# EAGLE design TicTacToe (EAGLE 7.2.0)
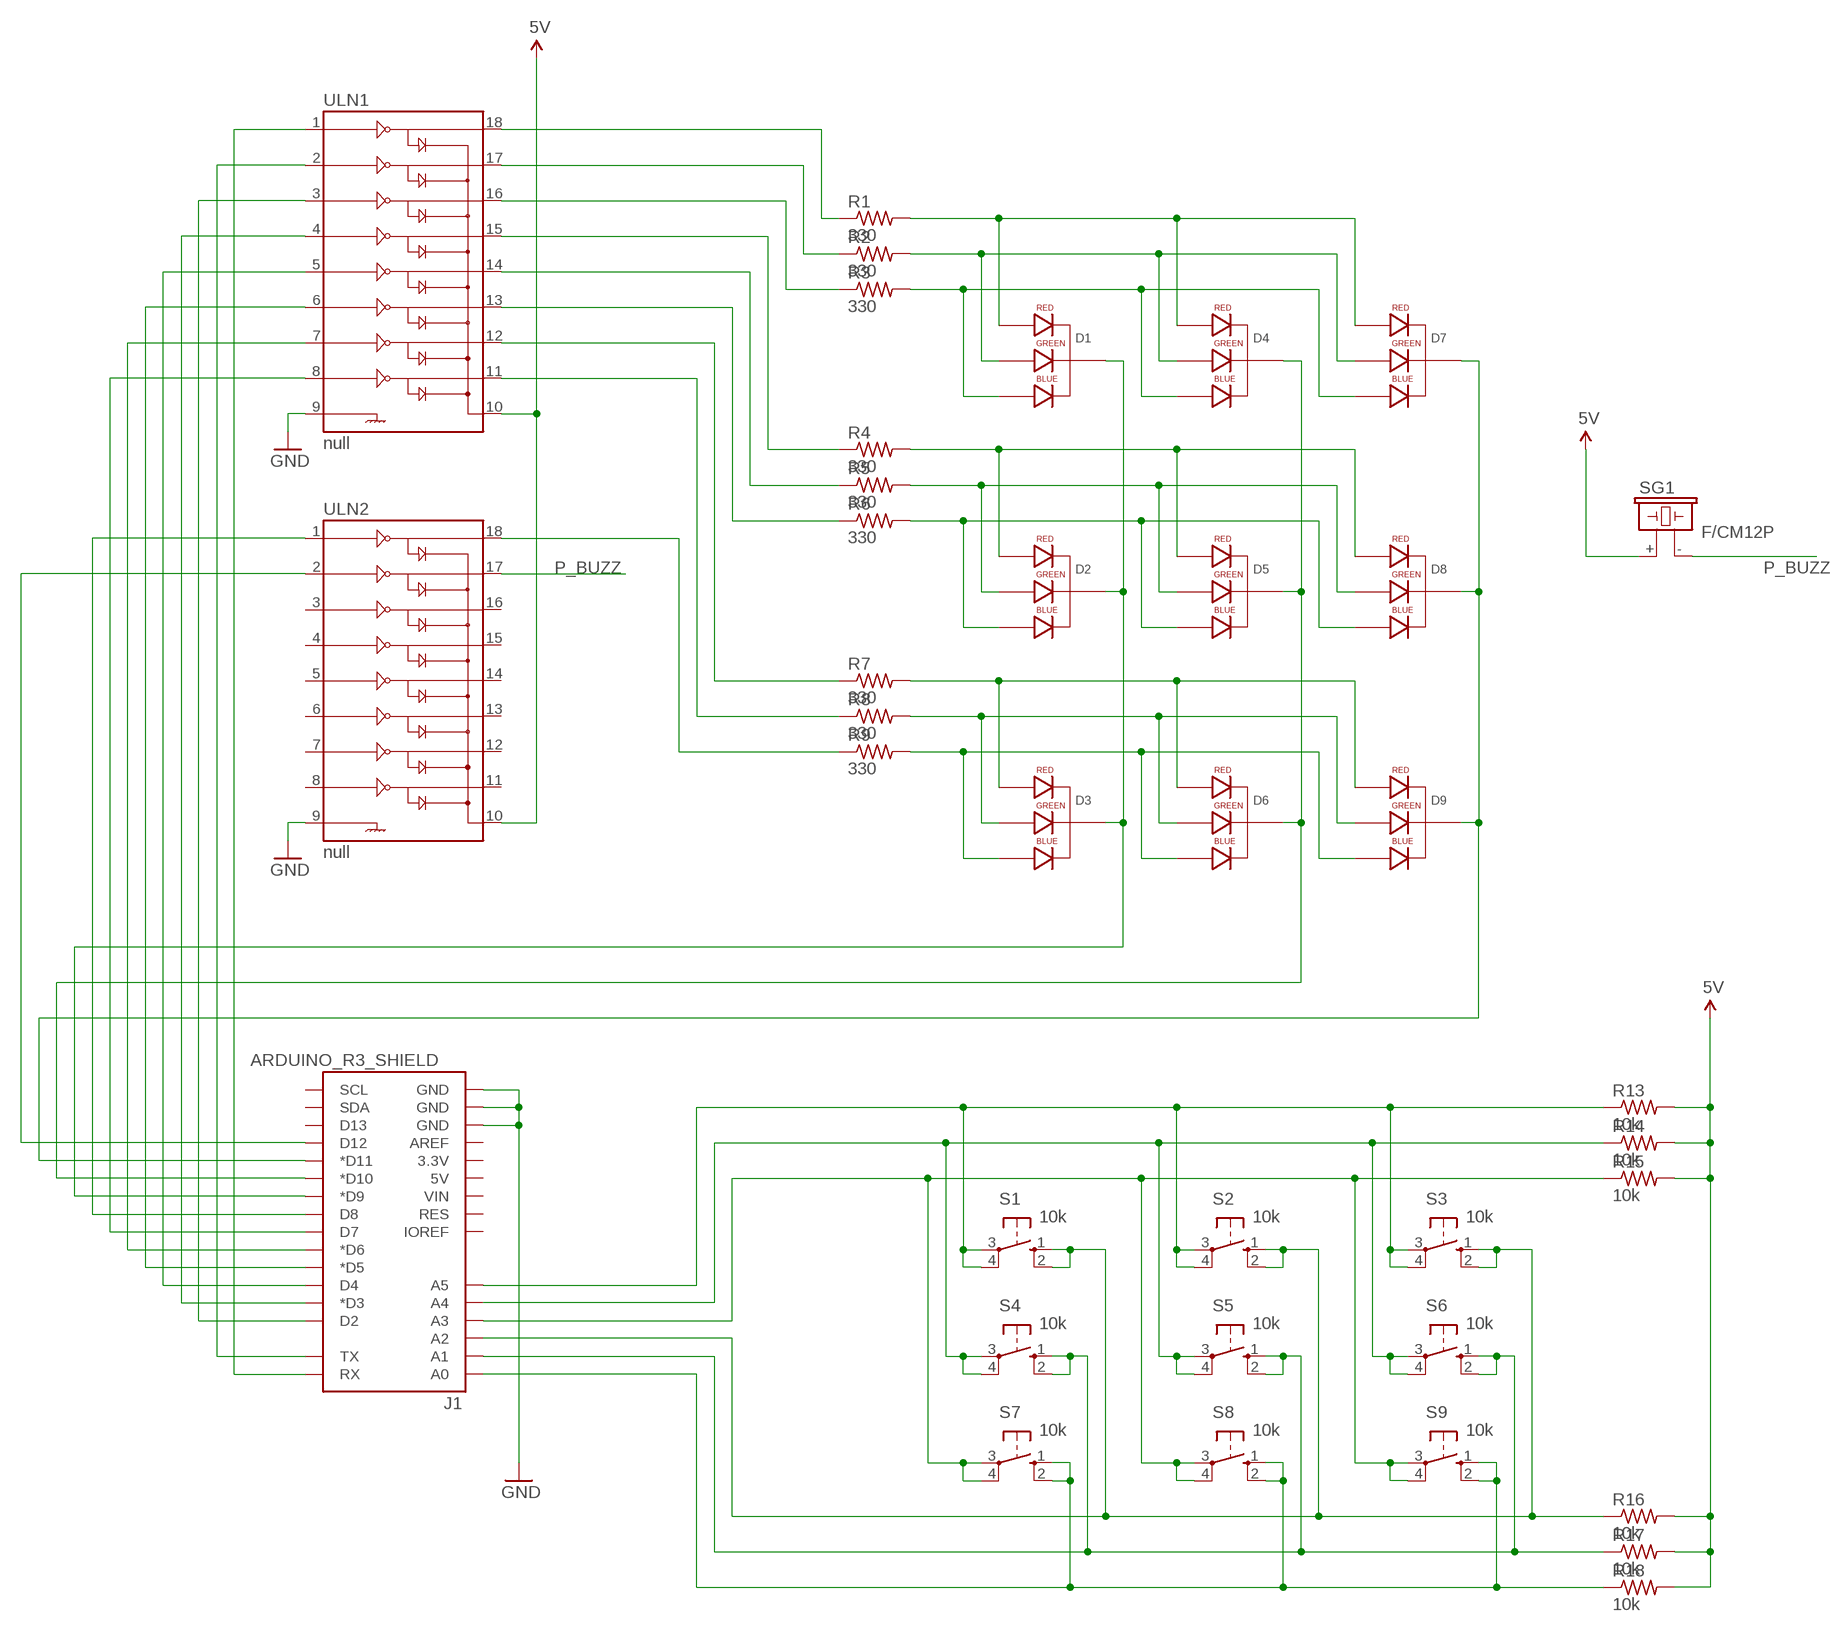
[diagram p0: schematic, sheet 1]

## Parts
D1  LED-RGB-CC-THRUCLEAR  [LED-RGB-THRU]
D2  LED-RGB-CC-THRUCLEAR  [LED-RGB-THRU]
D3  LED-RGB-CC-THRUCLEAR  [LED-RGB-THRU]
D4  LED-RGB-CC-THRUCLEAR  [LED-RGB-THRU]
D5  LED-RGB-CC-THRUCLEAR  [LED-RGB-THRU]
D6  LED-RGB-CC-THRUCLEAR  [LED-RGB-THRU]
D7  LED-RGB-CC-THRUCLEAR  [LED-RGB-THRU]
D8  LED-RGB-CC-THRUCLEAR  [LED-RGB-THRU]
D9  LED-RGB-CC-THRUCLEAR  [LED-RGB-THRU]
J1  ARDUINO_R3_SHIELD  [UNO_R3_SHIELD]
R1  330  R-US_0204/7  [0204/7]
R2  330  R-US_0204/7  [0204/7]
R3  330  R-US_0204/7  [0204/7]
R4  330  R-US_0204/7  [0204/7]
R5  330  R-US_0204/7  [0204/7]
R6  330  R-US_0204/7  [0204/7]
R7  330  R-US_0204/7  [0204/7]
R8  330  R-US_0204/7  [0204/7]
R9  330  R-US_0204/7  [0204/7]
R13  10k  R-US_0204/7  [0204/7]
R14  10k  R-US_0204/7  [0204/7]
R15  10k  R-US_0204/7  [0204/7]
R16  10k  R-US_0204/7  [0204/7]
R17  10k  R-US_0204/7  [0204/7]
R18  10k  R-US_0204/7  [0204/7]
S1  10k  10-XX  [B3F-10XX]
S2  10k  10-XX  [B3F-10XX]
S3  10k  10-XX  [B3F-10XX]
S4  10k  10-XX  [B3F-10XX]
S5  10k  10-XX  [B3F-10XX]
S6  10k  10-XX  [B3F-10XX]
S7  10k  10-XX  [B3F-10XX]
S8  10k  10-XX  [B3F-10XX]
S9  10k  10-XX  [B3F-10XX]
SG1  F/CM12P  [F/CM12P]
ULN1  null  ULN2803DIP  [DIL18]
ULN2  null  ULN2803DIP  [DIL18]

## Nets
5V: R13.2 R14.2 R15.2 R16.2 R17.2 R18.2 SG1.+ ULN1.10 ULN2.10
GND: J1.GND@0(GND) J1.GND@1(GND) J1.GND@2(GND) ULN1.9 ULN2.9
N$1: D1.1(RED_CATHODE) D4.1(RED_CATHODE) D7.1(RED_CATHODE) R1.2
N$2: D1.3(GREEN_CATHODE) D4.3(GREEN_CATHODE) D7.3(GREEN_CATHODE) R2.2
N$3: D1.4(BLUE_CATHODE) D4.4(BLUE_CATHODE) D7.4(BLUE_CATHODE) R3.2
N$4: D2.4(BLUE_CATHODE) D5.4(BLUE_CATHODE) D8.4(BLUE_CATHODE) R6.2
N$5: D2.1(RED_CATHODE) D5.1(RED_CATHODE) D8.1(RED_CATHODE) R4.2
N$6: D2.3(GREEN_CATHODE) D5.3(GREEN_CATHODE) D8.3(GREEN_CATHODE) R5.2
N$7: D3.1(RED_CATHODE) D6.1(RED_CATHODE) D9.1(RED_CATHODE) R7.2
N$8: D3.3(GREEN_CATHODE) D6.3(GREEN_CATHODE) D9.3(GREEN_CATHODE) R8.2
N$9: D3.4(BLUE_CATHODE) D6.4(BLUE_CATHODE) D9.4(BLUE_CATHODE) R9.2
N$13: J1.A5 R13.1 S1.3(P) S1.4(P1) S2.3(P) S2.4(P1) S3.3(P) S3.4(P1)
N$18: J1.A0 R18.1 S7.1(S) S7.2(S1) S8.1(S) S8.2(S1) S9.1(S) S9.2(S1)
N$19: R1.1 ULN1.18
N$20: R2.1 ULN1.17
N$21: R3.1 ULN1.16
N$22: R4.1 ULN1.15
N$23: R5.1 ULN1.14
N$24: R6.1 ULN1.13
N$25: R7.1 ULN1.12
N$26: R8.1 ULN1.11
N$27: R9.1 ULN2.18
N$28: J1.RX ULN1.1
N$29: J1.TX ULN1.2
N$30: J1.D8 ULN2.1
N$31: J1.D2 ULN1.3
N$32: J1.D3(*D3) ULN1.4
N$33: J1.D4 ULN1.5
N$34: J1.D5(*D5) ULN1.6
N$35: J1.D6(*D6) ULN1.7
N$36: J1.D7 ULN1.8
N$37: D1.2(CATHODE) D2.2(CATHODE) D3.2(CATHODE) J1.D9(*D9)
N$41: J1.D12 ULN2.2
N$42: D4.2(CATHODE) D5.2(CATHODE) D6.2(CATHODE) J1.D10(*D10)
N$43: D7.2(CATHODE) D8.2(CATHODE) D9.2(CATHODE) J1.D11(*D11)
N$44: J1.A1 R17.1 S4.1(S) S4.2(S1) S5.1(S) S5.2(S1) S6.1(S) S6.2(S1)
N$45: J1.A2 R16.1 S1.1(S) S1.2(S1) S2.1(S) S2.2(S1) S3.1(S) S3.2(S1)
N$46: J1.A3 R15.1 S7.3(P) S7.4(P1) S8.3(P) S8.4(P1) S9.3(P) S9.4(P1)
N$47: J1.A4 R14.1 S4.3(P) S4.4(P1) S5.3(P) S5.4(P1) S6.3(P) S6.4(P1)
P_BUZZ: SG1.- ULN2.17
Unconnected: J1.3.3V J1.5V J1.AREF J1.D13 J1.IOREF J1.RES J1.SCL J1.SDA J1.VIN ULN2.3 ULN2.4 ULN2.5 ULN2.6 ULN2.7 ULN2.8 ULN2.11 ULN2.12 ULN2.13 ULN2.14 ULN2.15 ULN2.16

## Library data of the parts
D1-D9 = SparkFun-LED:LED-RGB-CC-THRU: RGB Through-hole common cathode LED SparkFun Storefront: COM-00105 (Clear) COM-09264 (Diffuse); PROD_ID: DIO-08418
J1 = SparkFun-Boards:ARDUINO_R3_SHIELD: Shield form compatible with the Arduino Uno R3.
R1-R9 R13-R18 = rcl:R-US_: RESISTOR, American symbol
S1-S9 = switch-omron:10-XX: OMRON SWITCH; MPN: B3F-1000; OC_FARNELL: 176432; OC_NEWARK: 36M3542
SG1 = buzzer:F/CM12P: BUZZER Source: Buerklin; OC_FARNELL: unknown; OC_NEWARK: unknown
ULN1 ULN2 = SparkFun-PowerIC:ULN2803: Darlington Driver ULN2803 Darlington array. 500mA max per channel, 8-channel package. Spark Fun Electronics SKU : COM-00312

## Board
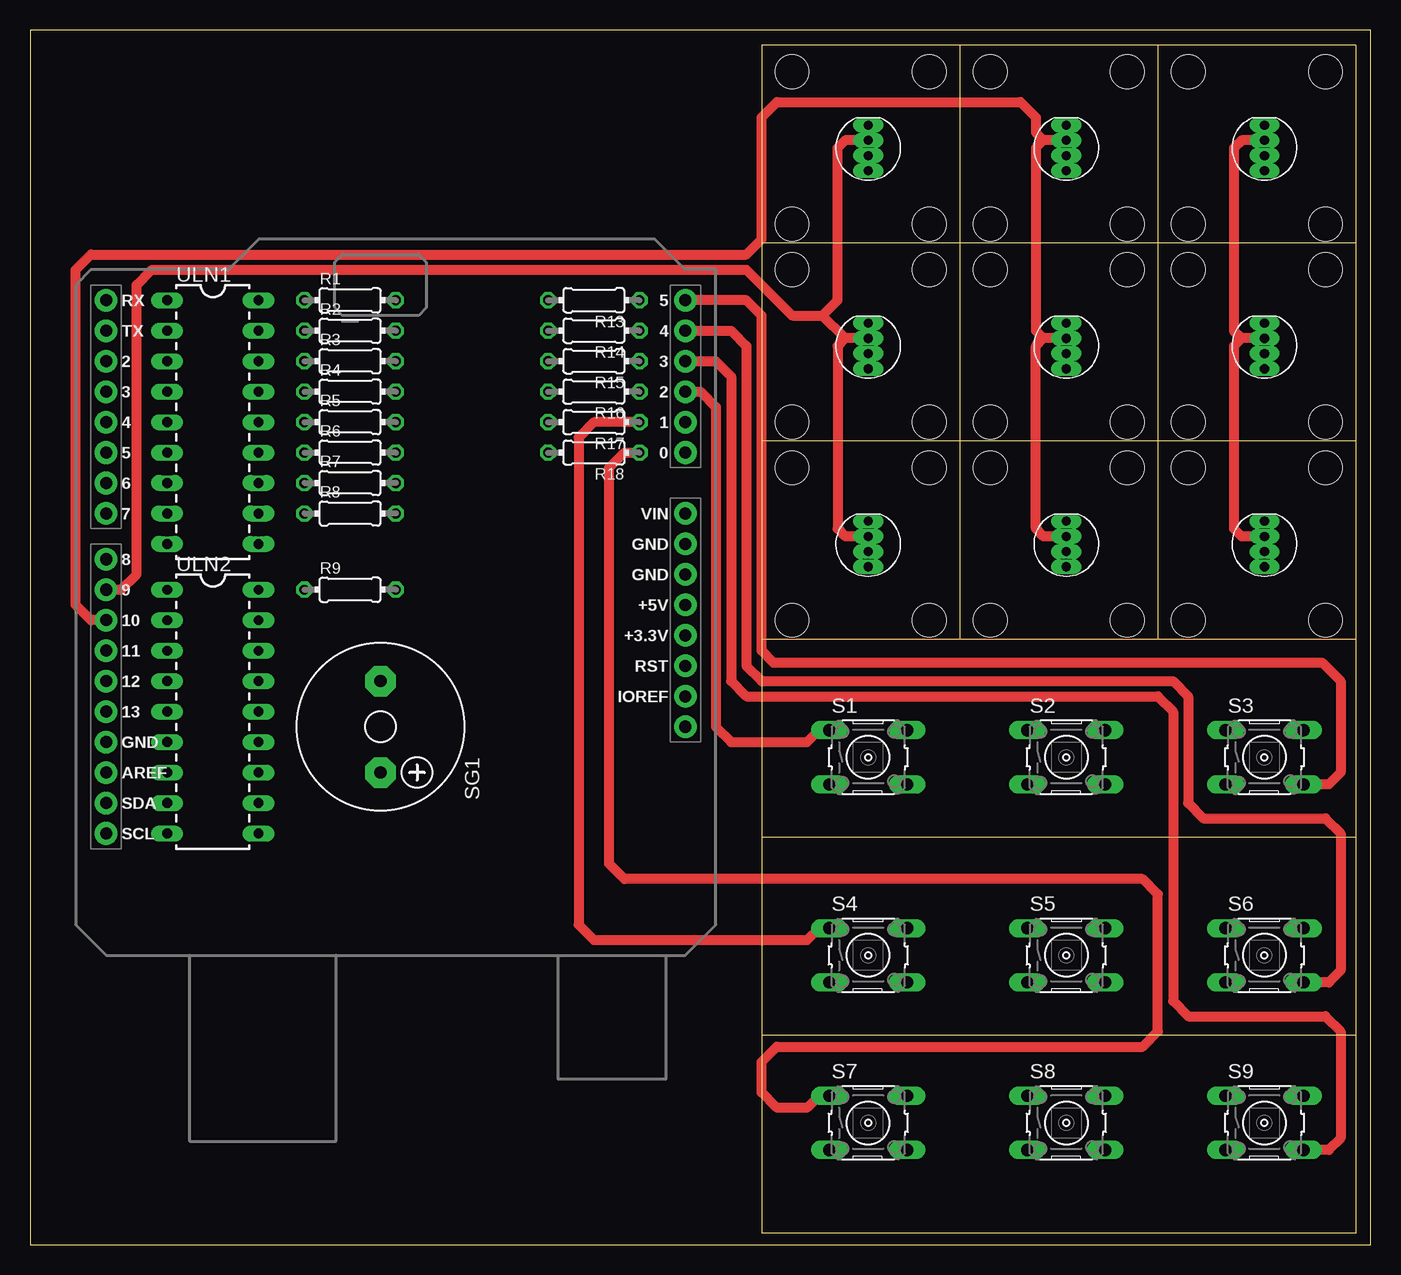
[diagram p1: board, top side]
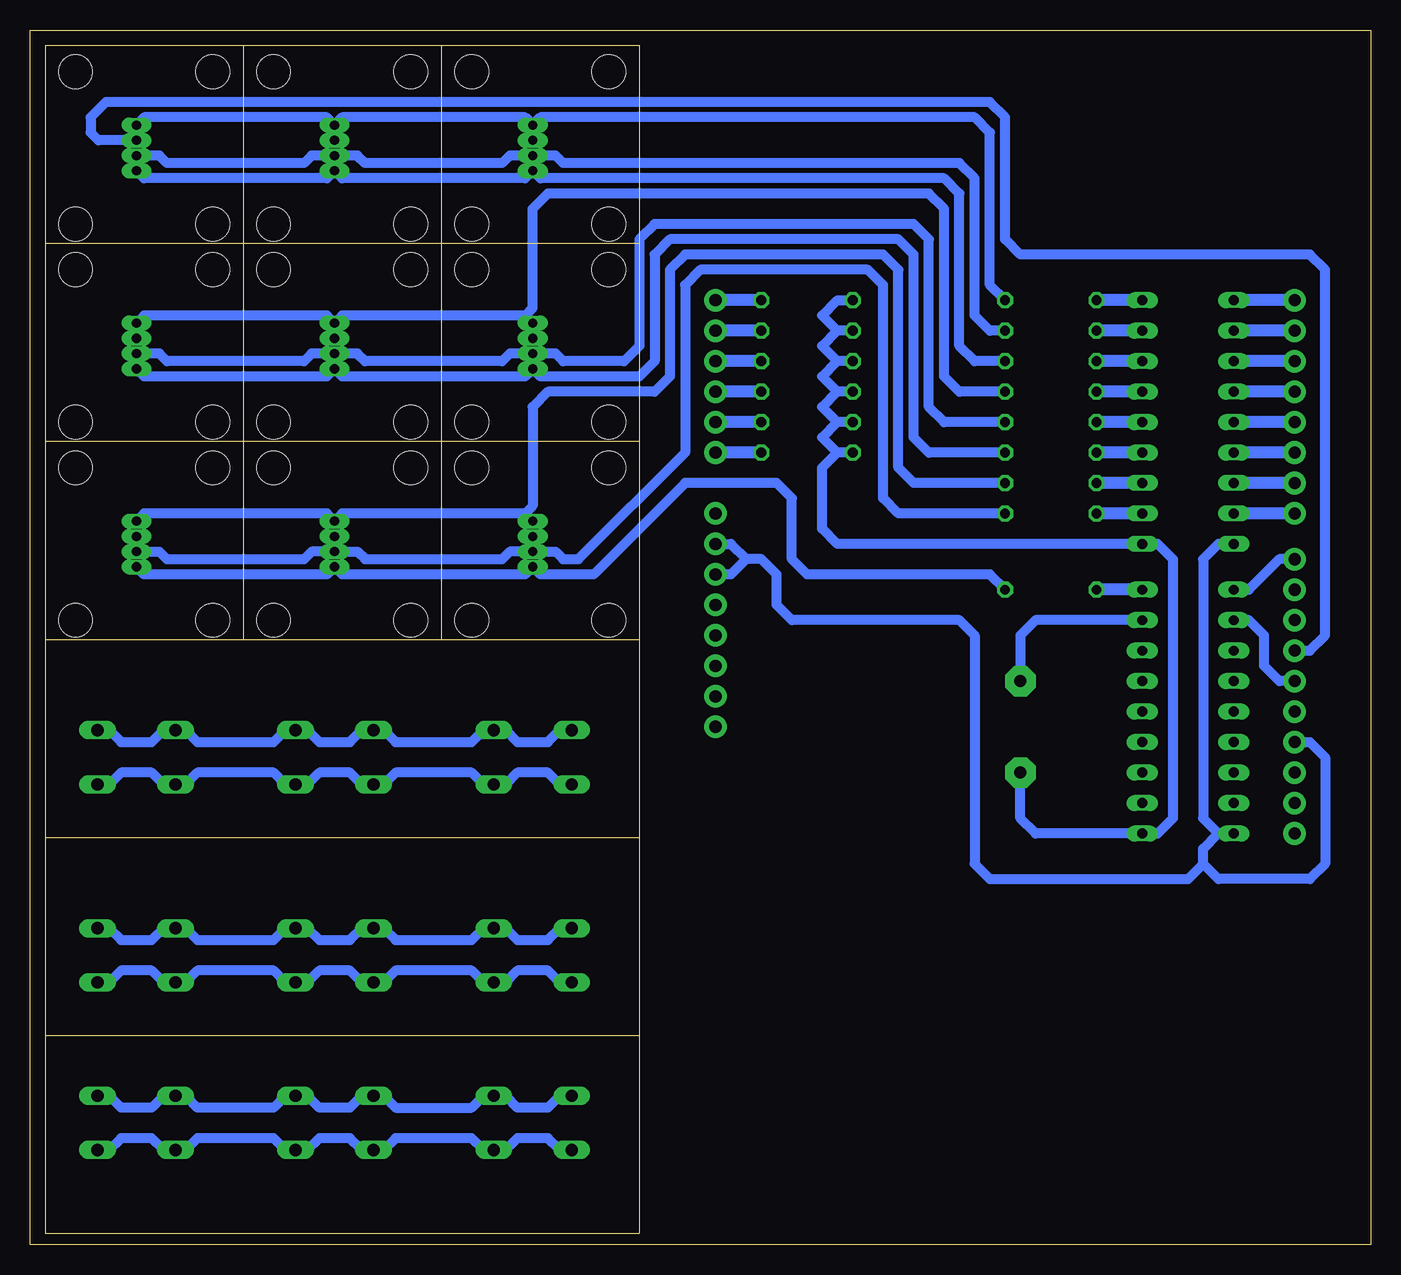
[diagram p2: board, bottom side, seen from below]

Size 111.74 x 101.27 mm. Coordinates in mm from the lower left corner, seen from the top.
Outline: 60.96,83.49 60.96,100 77.47,100
Outline: 60.96,83.49 60.96,66.98
Outline: 60.96,66.98 60.96,50.47
Outline: 110.49,100 110.49,83.49
Outline: 110.49,83.49 110.49,66.98
Outline: 110.49,66.98 110.49,50.47
Outline: 110.47,100 93.98,100
Outline: 93.98,100 77.47,100
Outline: 77.47,100 77.47,83.49
Outline: 77.47,83.49 77.47,66.98
Outline: 77.47,66.98 77.47,50.47
Outline: 93.98,100 93.98,83.49
Outline: 93.98,83.49 93.98,66.98
Outline: 93.98,66.98 93.98,50.47
Outline: 93.98,83.49 77.47,83.49
Outline: 93.98,66.98 77.47,66.98
Outline: 93.98,50.47 77.47,50.47
Outline: 77.47,83.49 60.96,83.49
Outline: 77.47,66.98 60.96,66.98
Outline: 77.47,50.47 60.96,50.47
Outline: 110.49,50.47 93.98,50.47
Outline: 110.49,66.98 93.98,66.98
Outline: 110.49,83.49 93.98,83.49
Outline: 60.96,50.47 60.96,33.96
Outline: 110.49,33.96 60.96,33.96
Outline: 110.49,50.47 110.49,33.96
Outline: 60.96,33.96 60.96,17.45
Outline: 110.49,33.96 110.49,17.45
Outline: 110.49,17.45 60.96,17.45
Outline: 60.96,17.45 60.96,0.94 110.49,0.94 110.49,17.45
Outline: 0,0 111.74,0 111.74,101.27 0,101.27 0,0
Copper layers (1*16): Top 0.035mm / dielectric 1.5mm / Bottom 0.035mm
Design rules "default": minimum track width 10mil, minimum drill 24mil, track to track 8mil, track to pad 8mil, pad to pad 8mil, via to via 8mil, smd to smd 8mil, copper to edge 40mil, drill to drill 8mil, minimum pad ring 10mil, minimum via ring 8mil, stop-mask expansion 4mil, vias tented up to drill 0mil, thermal gap 10mil
Holes 2.8 mm at 63.5,64.77 74.93,64.77 63.5,52.07 74.93,52.07 80.01,64.77 91.44,64.77 80.01,52.07 91.44,52.07 96.52,64.77 107.95,64.77 96.52,52.07 107.95,52.07 63.5,81.28 74.93,81.28 63.5,68.58 74.93,68.58 63.5,97.79 74.93,97.79 63.5,85.09 74.93,85.09 80.01,81.28 91.44,81.28 80.01,68.58 91.44,68.58 96.52,81.28 107.95,81.28 96.52,68.58 107.95,68.58 80.01,97.79 91.44,97.79 80.01,85.09 91.44,85.09 96.52,97.79 107.95,97.79 96.52,85.09 107.95,85.09

### Footprints (pad centres in the part's own frame; a part is rotated, then mirrored left to right if it is on the bottom)
LED-RGB-THRU = drill 0.762 pad 0.889 long: 1 1.905,0; 2 0.635,0; 3 -0.635,0; 4 -1.905,0
UNO_R3_SHIELD = drill 1.016 pad 1.88: 3.3V 50.8,26.67; 5V 50.8,29.21; A0 50.8,41.91; A1 50.8,44.45; A2 50.8,46.99; A3 50.8,49.53; A4 50.8,52.07; A5 50.8,54.61; AREF 2.54,15.24; D2 2.54,49.53; D3 2.54,46.99; D4 2.54,44.45; D5 2.54,41.91; D6 2.54,39.37; D7 2.54,36.83; D8 2.54,33.02; D9 2.54,30.48; D10 2.54,27.94; D11 2.54,25.4; D12 2.54,22.86; D13 2.54,20.32; GND@0 50.8,31.75; GND@1 50.8,34.29; GND@2 2.54,17.78; IOREF 50.8,21.59; NC 50.8,19.05; RES 50.8,24.13; RX 2.54,54.61; SCL 2.54,10.16; SDA 2.54,12.7; TX 2.54,52.07; VIN 50.8,36.83
0204/7 = drill 0.813 octagon: 1 -3.81,0; 2 3.81,0
B3F-10XX = drill 1.016 long: 1 -3.251,2.261; 2 3.251,2.261; 3 -3.251,-2.261; 4 3.251,-2.261
F/CM12P = drill 1.016 pad 2.54 octagon: + 3.81,0; - -3.81,0
DIL18 = drill 0.813 long: 1 -10.16,-3.81; 2 -7.62,-3.81; 3 -5.08,-3.81; 4 -2.54,-3.81; 5 0,-3.81; 6 2.54,-3.81; 7 5.08,-3.81; 8 7.62,-3.81; 9 10.16,-3.81; 10 10.16,3.81; 11 7.62,3.81; 12 5.08,3.81; 13 2.54,3.81; 14 0,3.81; 15 -2.54,3.81; 16 -5.08,3.81; 17 -7.62,3.81; 18 -10.16,3.81

### Placement (x,y rotation side)
D1  69.85,91.44 90 top
D2  69.85,74.93 90 top
D3  69.85,58.42 90 top
D4  86.36,91.44 90 top
D5  86.36,74.93 90 top
D6  86.36,58.42 90 top
D7  102.87,91.44 90 top
D8  102.87,74.93 90 top
D9  102.87,58.42 90 top
J1  3.81,24.13 0 top
R1  26.67,78.74 0 top
R2  26.67,76.2 0 top
R3  26.67,73.66 0 top
R4  26.67,71.12 0 top
R5  26.67,68.58 0 top
R6  26.67,66.04 0 top
R7  26.67,63.5 0 top
R8  26.67,60.96 0 top
R9  26.67,54.61 0 top
R13  46.99,78.74 180 top
R14  46.99,76.2 180 top
R15  46.99,73.66 180 top
R16  46.99,71.12 180 top
R17  46.99,68.58 180 top
R18  46.99,66.04 180 top
S1  69.85,40.64 0 top
S2  86.36,40.64 0 top
S3  102.87,40.64 0 top
S4  69.85,24.13 0 top
S5  86.36,24.13 0 top
S6  102.87,24.13 0 top
S7  69.85,10.16 0 top
S8  86.36,10.16 0 top
S9  102.87,10.16 0 top
SG1  29.21,43.18 270 top
ULN1  15.24,68.58 270 top
ULN2  15.24,44.45 270 top

### Tracks (layer width: path | path; a pad name or v marks a point on that pad's centre or on a via)
5V
  Bottom 0.813: 44.45,66.04 45.72,64.77 45.72,59.69 44.45,58.42 ULN1.10 17.78,58.42 16.51,57.15 16.51,35.56 17.78,34.29 ULN2.10 27.94,34.29 29.21,35.56 SG1.+ | R18.2 44.45,66.04 | 44.45,66.04 45.72,67.31 44.45,68.58 | R17.2 44.45,68.58 | 44.45,68.58 45.72,69.85 44.45,71.12 | R16.2 44.45,71.12 | 44.45,71.12 45.72,72.39 44.45,73.66 | R15.2 44.45,73.66 | 44.45,73.66 45.72,74.93 44.45,76.2 | R14.2 44.45,76.2 | 44.45,76.2 45.72,77.47 44.45,78.74 R13.2
GND
  Bottom 0.813: J1.GND@2 5.08,41.91 3.81,40.64 3.81,31.75 5.08,30.48 12.7,30.48 13.97,31.75 | ULN1.9 12.7,58.42 13.97,57.15 13.97,35.56 12.7,34.29 | ULN2.9 12.7,34.29 | 13.97,31.75 13.97,33.02 12.7,34.29 | J1.GND@1 53.34,58.42 52.07,57.15 | J1.GND@0 53.34,55.88 52.07,57.15 | 13.97,31.75 15.24,30.48 31.75,30.48 33.02,31.75 33.02,50.8 34.29,52.07 48.26,52.07 49.53,53.34 49.53,55.88 50.8,57.15 52.07,57.15
N$1
  Bottom 0.813: D7.1 102.23,93.98 87,93.98 D4.1 85.72,93.98 70.48,93.98 D1.1 69.22,93.98 33.02,93.98 31.75,92.71 31.75,80.01 R1.2
N$2
  Bottom 0.813: D7.3 100.97,90.81 100.33,90.17 88.9,90.17 88.27,90.81 D4.3 84.45,90.81 83.82,90.17 72.39,90.17 71.75,90.81 D1.3 67.94,90.81 67.31,90.17 34.29,90.17 33.02,88.9 33.02,77.47 31.75,76.2 R2.2
N$3
  Bottom 0.813: D7.4 102.23,88.9 87,88.9 D4.4 85.72,88.9 70.48,88.9 D1.4 69.22,88.9 35.56,88.9 34.29,87.63 34.29,74.93 33.02,73.66 R3.2
N$4
  Bottom 0.813: D8.4 102.23,72.39 87,72.39 D5.4 85.72,72.39 70.48,72.39 D2.4 69.22,72.39 60.96,72.39 59.69,73.66 59.69,82.55 58.42,83.82 39.37,83.82 38.1,82.55 38.1,67.31 36.83,66.04 R6.2
N$5
  Bottom 0.813: D2.1 70.48,77.47 | 70.48,77.47 85.72,77.47 D5.1 87,77.47 102.23,77.47 D8.1 | R4.2 34.29,71.12 35.56,72.39 35.56,86.36 36.83,87.63 68.58,87.63 69.85,86.36 69.85,78.11 70.48,77.47
N$6
  Bottom 0.813: D8.3 100.97,74.3 100.33,73.66 88.9,73.66 88.27,74.3 D5.3 84.45,74.3 83.82,73.66 72.39,73.66 71.75,74.3 D2.3 67.94,74.3 67.31,73.66 62.23,73.66 60.96,74.93 60.96,83.82 59.69,85.09 38.1,85.09 36.83,83.82 36.83,69.85 35.56,68.58 R5.2
N$7
  Bottom 0.813: D3.1 70.48,60.96 | 70.48,60.96 85.72,60.96 D6.1 87,60.96 102.23,60.96 D9.1 | R7.2 38.1,63.5 39.37,64.77 39.37,81.28 40.64,82.55 57.15,82.55 58.42,81.28 58.42,72.39 59.69,71.12 68.58,71.12 69.85,69.85 69.85,61.59 70.48,60.96
N$8
  Bottom 0.813: D9.3 100.97,57.79 100.33,57.15 88.9,57.15 88.27,57.79 D6.3 84.45,57.79 83.82,57.15 72.39,57.15 71.75,57.79 D3.3 67.94,57.79 67.31,57.15 66.04,57.15 57.15,66.04 57.15,80.01 55.88,81.28 41.91,81.28 40.64,80.01 40.64,62.23 39.37,60.96 R8.2
N$9
  Bottom 0.813: D9.4 102.23,55.88 87,55.88 D6.4 85.72,55.88 70.48,55.88 D3.4 69.22,55.88 64.77,55.88 57.15,63.5 49.53,63.5 48.26,62.23 48.26,57.15 46.99,55.88 31.75,55.88 R9.2
N$13
  Top 0.813: J1.A5 59.69,78.74 60.96,77.47 60.96,49.53 61.95,48.54 107.67,48.54 109.22,46.99 109.22,39.37 108.23,38.38 S3.4
  Bottom 0.813: S3.4 105.13,38.38 104.14,39.37 101.6,39.37 100.61,38.38 S3.3 98.78,38.38 97.79,39.37 91.44,39.37 90.45,38.38 S2.4 88.62,38.38 87.63,39.37 85.09,39.37 84.1,38.38 S2.3 82.27,38.38 81.28,39.37 74.93,39.37 73.94,38.38 S1.4 72.11,38.38 71.12,39.37 68.58,39.37 67.59,38.38 S1.3
  Bottom 1.016: R13.1 J1.A5
N$18
  Top 0.813: R18.1 49.53,66.04 48.26,64.77 48.26,31.75 49.53,30.48 92.71,30.48 93.98,29.21 93.98,17.78 92.71,16.51 62.23,16.51 60.96,15.24 60.96,12.7 62.23,11.43 64.77,11.43 65.76,12.42 S7.1
  Bottom 0.813: S7.1 67.59,12.42 68.58,11.43 71.12,11.43 72.11,12.42 S7.2 73.94,12.42 74.93,11.43 81.28,11.43 82.27,12.42 S8.1 84.1,12.42 85.09,11.43 87.63,11.43 88.62,12.42 S8.2 90.45,12.42 91.44,11.43 97.79,11.43 98.78,12.42 S9.1 100.61,12.42 101.6,11.43 104.14,11.43 105.13,12.42 S9.2
  Bottom 1.016: R18.1 J1.A0
N$19
  Bottom 1.016: ULN1.18 R1.1
N$20
  Bottom 1.016: ULN1.17 R2.1
N$21
  Bottom 1.016: ULN1.16 R3.1
N$22
  Bottom 1.016: ULN1.15 R4.1
N$23
  Bottom 1.016: ULN1.14 R5.1
N$24
  Bottom 1.016: ULN1.13 R6.1
N$25
  Bottom 1.016: ULN1.12 R7.1
N$26
  Bottom 1.016: ULN1.11 R8.1
N$27
  Bottom 1.016: ULN2.18 R9.1
N$28
  Bottom 1.016: J1.RX ULN1.1
N$29
  Bottom 1.016: J1.TX ULN1.2
N$30
  Bottom 0.813: J1.D8 7.62,57.15 10.16,54.61 ULN2.1
N$31
  Bottom 1.016: J1.D2 ULN1.3
N$32
  Bottom 1.016: J1.D3 ULN1.4
N$33
  Bottom 1.016: J1.D4 ULN1.5
N$34
  Bottom 1.016: J1.D5 ULN1.6
N$35
  Bottom 1.016: J1.D6 ULN1.7
N$36
  Bottom 1.016: J1.D7 ULN1.8
N$37
  Top 0.813: D1.2 67.94,92.08 67.31,91.44 67.31,78.74 66.04,77.47 | D2.2 67.94,75.56 | 67.94,75.56 67.31,74.93 67.31,59.69 67.94,59.05 D3.2 | J1.D9 7.62,54.61 8.89,55.88 8.89,80.01 10.16,81.28 59.69,81.28 63.5,77.47 66.04,77.47 | 67.94,75.56 66.04,77.47
N$41
  Bottom 0.813: J1.D12 7.62,46.99 8.89,48.26 8.89,50.8 10.16,52.07 ULN2.2
N$42
  Top 0.813: D4.2 84.45,92.08 | 84.45,92.08 83.82,91.44 83.82,76.2 84.45,75.56 | D5.2 84.45,75.56 | 84.45,75.56 83.82,74.93 83.82,59.69 84.45,59.05 D6.2 | J1.D10 5.08,52.07 3.81,53.34 3.81,81.28 5.08,82.55 59.69,82.55 60.96,83.82 60.96,93.98 62.23,95.25 82.55,95.25 83.82,93.98 83.82,92.71 84.45,92.08
N$43
  Top 0.813: D7.2 100.97,92.08 100.33,91.44 100.33,76.2 100.97,75.56 | 100.97,75.56 100.33,74.93 100.33,59.69 100.97,59.05 D9.2 | D8.2 100.97,75.56
  Bottom 0.813: J1.D11 5.08,49.53 3.81,50.8 3.81,81.28 5.08,82.55 29.21,82.55 30.48,83.82 30.48,93.98 31.75,95.25 105.41,95.25 106.68,93.98 106.68,92.71 106.05,92.08 D7.2
N$44
  Top 0.813: R17.1 46.99,68.58 45.72,67.31 45.72,26.67 46.99,25.4 64.77,25.4 65.76,26.39 S4.1
  Bottom 0.813: S4.1 67.59,26.39 68.58,25.4 71.12,25.4 72.11,26.39 S4.2 73.94,26.39 74.93,25.4 81.28,25.4 82.27,26.39 S5.1 84.1,26.39 85.09,25.4 87.63,25.4 88.62,26.39 S5.2 90.45,26.39 91.44,25.4 97.79,25.4 98.78,26.39 S6.1 100.61,26.39 101.6,25.4 104.14,25.4 105.13,26.39 S6.2
  Bottom 1.016: R17.1 J1.A1
N$45
  Top 0.813: J1.A2 55.88,71.12 57.15,69.85 57.15,43.18 58.42,41.91 64.77,41.91 65.76,42.9 S1.1
  Bottom 0.813: S1.1 67.59,42.9 68.58,41.91 71.12,41.91 72.11,42.9 S1.2 73.94,42.9 74.93,41.91 81.28,41.91 82.27,42.9 S2.1 84.1,42.9 85.09,41.91 87.63,41.91 88.62,42.9 S2.2 90.45,42.9 91.44,41.91 97.79,41.91 98.78,42.9 S3.1 100.61,42.9 101.6,41.91 104.14,41.91 105.13,42.9 S3.2
  Bottom 1.016: R16.1 J1.A2
N$46
  Top 0.813: J1.A3 57.15,73.66 58.42,72.39 58.42,46.99 59.69,45.72 93.98,45.72 95.25,44.45 95.25,20.32 96.52,19.05 107.95,19.05 109.22,17.78 109.22,8.89 108.23,7.9 S9.4
  Bottom 0.813: S7.3 67.59,7.9 68.58,8.89 71.12,8.89 72.11,7.9 S7.4 73.94,7.9 74.93,8.89 81.28,8.89 82.27,7.9 S8.3 84.1,7.9 85.09,8.89 87.63,8.89 88.62,7.9 S8.4 90.45,7.9 91.44,8.89 97.79,8.89 98.78,7.9 S9.3 100.61,7.9 101.6,8.89 104.14,8.89 105.13,7.9 S9.4
  Bottom 1.016: R15.1 J1.A3
N$47
  Top 0.813: J1.A4 58.42,76.2 59.69,74.93 59.69,48.26 60.96,46.99 95.25,46.99 96.52,45.72 96.52,36.83 97.79,35.56 107.95,35.56 109.22,34.29 109.22,22.86 108.23,21.87 S6.4
  Bottom 0.813: S4.3 67.59,21.87 68.58,22.86 71.12,22.86 72.11,21.87 S4.4 73.94,21.87 74.93,22.86 81.28,22.86 82.27,21.87 S5.3 84.1,21.87 85.09,22.86 87.63,22.86 88.62,21.87 S5.4 90.45,21.87 91.44,22.86 97.79,22.86 98.78,21.87 S6.3 100.61,21.87 101.6,22.86 104.14,22.86 105.13,21.87 S6.4
  Bottom 1.016: R14.1 J1.A4
P_BUZZ
  Bottom 0.813: ULN2.17 27.94,52.07 29.21,50.8 SG1.-